# EAGLE schematic EIB64-ST4-Multi (EAGLE 9.5.0)
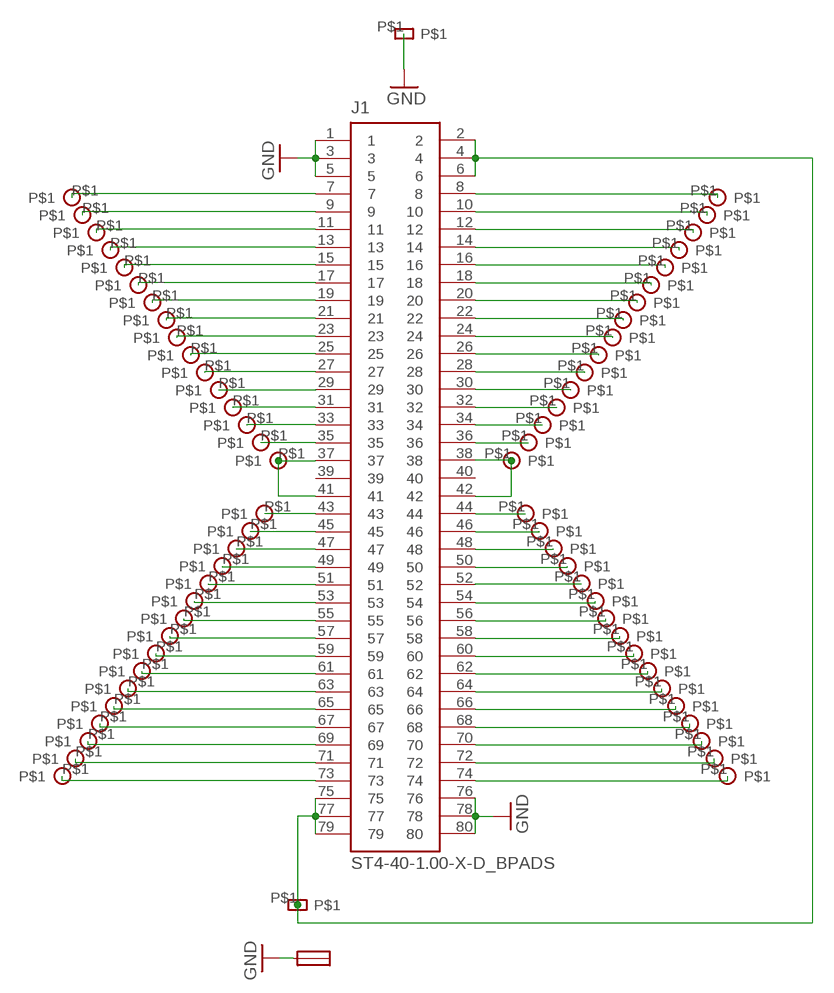
[diagram p0: schematic, sheet 1]

## Parts
J1  ST4-40-1.00-X-D_BPADS  [ST4-40-1.00-X-D_BPADS]
U$1  EIB-GND-HOLE-PAD-SMALL  [EIB-GND-HOLE-PAD-SMALL]
U$2  JMP-PAD-SMALL  [JMP-PAD-SMALL]
U$3  EIB-GND-HOLE-PAD-SMALL  [EIB-GND-HOLE-PAD-SMALL]
U$5  EIB-TETRODE-HOLE-RS-PAD  [EIB-TETRODE-HOLE-RS-PAD]
U$6  EIB-TETRODE-HOLE-RS-PAD  [EIB-TETRODE-HOLE-RS-PAD]
U$7  EIB-TETRODE-HOLE-RS-PAD  [EIB-TETRODE-HOLE-RS-PAD]
U$8  EIB-TETRODE-HOLE-RS-PAD  [EIB-TETRODE-HOLE-RS-PAD]
U$9  EIB-TETRODE-HOLE-RS-PAD  [EIB-TETRODE-HOLE-RS-PAD]
U$10  EIB-TETRODE-HOLE-RS-PAD  [EIB-TETRODE-HOLE-RS-PAD]
U$11  EIB-TETRODE-HOLE-RS-PAD  [EIB-TETRODE-HOLE-RS-PAD]
U$12  EIB-TETRODE-HOLE-RS-PAD  [EIB-TETRODE-HOLE-RS-PAD]
U$13  EIB-TETRODE-HOLE-RS-PAD  [EIB-TETRODE-HOLE-RS-PAD]
U$14  EIB-TETRODE-HOLE-RS-PAD  [EIB-TETRODE-HOLE-RS-PAD]
U$15  EIB-TETRODE-HOLE-RS-PAD  [EIB-TETRODE-HOLE-RS-PAD]
U$16  EIB-TETRODE-HOLE-RS-PAD  [EIB-TETRODE-HOLE-RS-PAD]
U$17  EIB-TETRODE-HOLE-RS-PAD  [EIB-TETRODE-HOLE-RS-PAD]
U$18  EIB-TETRODE-HOLE-RS-PAD  [EIB-TETRODE-HOLE-RS-PAD]
U$19  EIB-TETRODE-HOLE-RS-PAD  [EIB-TETRODE-HOLE-RS-PAD]
U$20  EIB-TETRODE-HOLE-RS-PAD  [EIB-TETRODE-HOLE-RS-PAD]
U$21  EIB-TETRODE-HOLE-RS-PAD  [EIB-TETRODE-HOLE-RS-PAD]
U$22  EIB-TETRODE-HOLE-RS-PAD  [EIB-TETRODE-HOLE-RS-PAD]
U$23  EIB-TETRODE-HOLE-RS-PAD  [EIB-TETRODE-HOLE-RS-PAD]
U$24  EIB-TETRODE-HOLE-RS-PAD  [EIB-TETRODE-HOLE-RS-PAD]
U$25  EIB-TETRODE-HOLE-RS-PAD  [EIB-TETRODE-HOLE-RS-PAD]
U$26  EIB-TETRODE-HOLE-RS-PAD  [EIB-TETRODE-HOLE-RS-PAD]
U$27  EIB-TETRODE-HOLE-RS-PAD  [EIB-TETRODE-HOLE-RS-PAD]
U$28  EIB-TETRODE-HOLE-RS-PAD  [EIB-TETRODE-HOLE-RS-PAD]
U$29  EIB-TETRODE-HOLE-RS-PAD  [EIB-TETRODE-HOLE-RS-PAD]
U$30  EIB-TETRODE-HOLE-RS-PAD  [EIB-TETRODE-HOLE-RS-PAD]
U$31  EIB-TETRODE-HOLE-RS-PAD  [EIB-TETRODE-HOLE-RS-PAD]
U$32  EIB-TETRODE-HOLE-RS-PAD  [EIB-TETRODE-HOLE-RS-PAD]
U$33  EIB-TETRODE-HOLE-RS-PAD  [EIB-TETRODE-HOLE-RS-PAD]
U$34  EIB-TETRODE-HOLE-RS-PAD  [EIB-TETRODE-HOLE-RS-PAD]
U$35  EIB-TETRODE-HOLE-RS-PAD  [EIB-TETRODE-HOLE-RS-PAD]
U$36  EIB-TETRODE-HOLE-RS-PAD  [EIB-TETRODE-HOLE-RS-PAD]
U$37  EIB-TETRODE-HOLE-RS-PAD  [EIB-TETRODE-HOLE-RS-PAD]
U$38  EIB-TETRODE-HOLE-RS-PAD  [EIB-TETRODE-HOLE-RS-PAD]
U$39  EIB-TETRODE-HOLE-RS-PAD  [EIB-TETRODE-HOLE-RS-PAD]
U$40  EIB-TETRODE-HOLE-RS-PAD  [EIB-TETRODE-HOLE-RS-PAD]
U$41  EIB-TETRODE-HOLE-RS-PAD  [EIB-TETRODE-HOLE-RS-PAD]
U$42  EIB-TETRODE-HOLE-RS-PAD  [EIB-TETRODE-HOLE-RS-PAD]
U$43  EIB-TETRODE-HOLE-RS-PAD  [EIB-TETRODE-HOLE-RS-PAD]
U$44  EIB-TETRODE-HOLE-RS-PAD  [EIB-TETRODE-HOLE-RS-PAD]
U$45  EIB-TETRODE-HOLE-RS-PAD  [EIB-TETRODE-HOLE-RS-PAD]
U$46  EIB-TETRODE-HOLE-RS-PAD  [EIB-TETRODE-HOLE-RS-PAD]
U$47  EIB-TETRODE-HOLE-RS-PAD  [EIB-TETRODE-HOLE-RS-PAD]
U$48  EIB-TETRODE-HOLE-RS-PAD  [EIB-TETRODE-HOLE-RS-PAD]
U$49  EIB-TETRODE-HOLE-RS-PAD  [EIB-TETRODE-HOLE-RS-PAD]
U$50  EIB-TETRODE-HOLE-RS-PAD  [EIB-TETRODE-HOLE-RS-PAD]
U$51  EIB-TETRODE-HOLE-RS-PAD  [EIB-TETRODE-HOLE-RS-PAD]
U$52  EIB-TETRODE-HOLE-RS-PAD  [EIB-TETRODE-HOLE-RS-PAD]
U$53  EIB-TETRODE-HOLE-RS-PAD  [EIB-TETRODE-HOLE-RS-PAD]
U$54  EIB-TETRODE-HOLE-RS-PAD  [EIB-TETRODE-HOLE-RS-PAD]
U$55  EIB-TETRODE-HOLE-RS-PAD  [EIB-TETRODE-HOLE-RS-PAD]
U$56  EIB-TETRODE-HOLE-RS-PAD  [EIB-TETRODE-HOLE-RS-PAD]
U$57  EIB-TETRODE-HOLE-RS-PAD  [EIB-TETRODE-HOLE-RS-PAD]
U$58  EIB-TETRODE-HOLE-RS-PAD  [EIB-TETRODE-HOLE-RS-PAD]
U$59  EIB-TETRODE-HOLE-RS-PAD  [EIB-TETRODE-HOLE-RS-PAD]
U$60  EIB-TETRODE-HOLE-RS-PAD  [EIB-TETRODE-HOLE-RS-PAD]
U$61  EIB-TETRODE-HOLE-RS-PAD  [EIB-TETRODE-HOLE-RS-PAD]
U$62  EIB-TETRODE-HOLE-RS-PAD  [EIB-TETRODE-HOLE-RS-PAD]
U$63  EIB-TETRODE-HOLE-RS-PAD  [EIB-TETRODE-HOLE-RS-PAD]
U$64  EIB-TETRODE-HOLE-RS-PAD  [EIB-TETRODE-HOLE-RS-PAD]
U$65  EIB-TETRODE-HOLE-RS-PAD  [EIB-TETRODE-HOLE-RS-PAD]
U$66  EIB-TETRODE-HOLE-RS-PAD  [EIB-TETRODE-HOLE-RS-PAD]
U$67  EIB-TETRODE-HOLE-RS-PAD  [EIB-TETRODE-HOLE-RS-PAD]
U$68  EIB-TETRODE-HOLE-RS-PAD  [EIB-TETRODE-HOLE-RS-PAD]

## Nets
GND [thick]: J1.1 J1.3 J1.5 J1.76 J1.78 J1.80 U$1.P$1 U$2.P$1
N$1 [thick]: J1.2 J1.4 J1.6 J1.75 J1.77 J1.79 U$3.P$1
N$2 [thick]: J1.35 U$7.P$1
N$3 [thick]: J1.36 U$5.P$1
N$4 [thick]: J1.34 U$9.P$1
N$5 [thick]: J1.20 U$16.P$1
N$6 [thick]: J1.22 U$15.P$1
N$7 [thick]: J1.24 U$14.P$1
N$8 [thick]: J1.26 U$13.P$1
N$9 [thick]: J1.28 U$12.P$1
N$13 [thick]: J1.30 U$11.P$1
N$14 [thick]: J1.37 J1.41 U$8.P$1
N$15 [thick]: J1.32 U$10.P$1
N$16 [thick]: J1.74 U$52.P$1
N$17 [thick]: J1.18 U$17.P$1
N$18 [thick]: J1.16 U$18.P$1
N$19 [thick]: J1.14 U$19.P$1
N$20 [thick]: J1.12 U$20.P$1
N$21 [thick]: J1.10 U$21.P$1
N$22 [thick]: J1.8 U$22.P$1
N$23 [thick]: J1.33 U$23.P$1
N$24 [thick]: J1.31 U$24.P$1
N$25 [thick]: J1.29 U$25.P$1
N$26 [thick]: J1.27 U$26.P$1
N$27 [thick]: J1.25 U$27.P$1
N$28 [thick]: J1.23 U$28.P$1
N$29 [thick]: J1.21 U$29.P$1
N$30 [thick]: J1.19 U$30.P$1
N$31 [thick]: J1.17 U$31.P$1
N$32 [thick]: J1.15 U$32.P$1
N$33 [thick]: J1.13 U$33.P$1
N$34 [thick]: J1.11 U$34.P$1
N$35 [thick]: J1.9 U$35.P$1
N$36 [thick]: J1.7 U$36.P$1
N$37 [thick]: J1.72 U$51.P$1
N$38 [thick]: J1.70 U$50.P$1
N$39 [thick]: J1.68 U$49.P$1
N$40 [thick]: J1.66 U$48.P$1
N$41 [thick]: J1.64 U$47.P$1
N$42 [thick]: J1.62 U$46.P$1
N$43 [thick]: J1.60 U$45.P$1
N$44 [thick]: J1.58 U$44.P$1
N$45 [thick]: J1.56 U$43.P$1
N$46 [thick]: J1.54 U$42.P$1
N$47 [thick]: J1.52 U$41.P$1
N$48 [thick]: J1.50 U$40.P$1
N$49 [thick]: J1.48 U$39.P$1
N$50 [thick]: J1.46 U$38.P$1
N$51 [thick]: J1.44 U$37.P$1
N$52 [thick]: J1.38 J1.42 U$6.P$1
N$53 [thick]: J1.43 U$53.P$1
N$54 [thick]: J1.45 U$54.P$1
N$55 [thick]: J1.47 U$55.P$1
N$56 [thick]: J1.49 U$56.P$1
N$57 [thick]: J1.51 U$57.P$1
N$58 [thick]: J1.53 U$58.P$1
N$59 [thick]: J1.55 U$59.P$1
N$60 [thick]: J1.57 U$60.P$1
N$61 [thick]: J1.59 U$61.P$1
N$62 [thick]: J1.61 U$62.P$1
N$63 [thick]: J1.63 U$63.P$1
N$64 [thick]: J1.65 U$64.P$1
N$65 [thick]: J1.67 U$65.P$1
N$66 [thick]: J1.69 U$66.P$1
N$67 [thick]: J1.71 U$67.P$1
N$68 [thick]: J1.73 U$68.P$1
Unconnected: J1.39 J1.40

## Library data of the parts
J1 = ST4-40-1.00-X-D_custom:ST4-40-1.00-X-D_BPADS: 0.4MM TERMINAL STRIP ASSEMBLY.
U$1 U$3 = EIBLibrary:EIB-GND-HOLE-PAD-SMALL
U$2 = EIBLibrary:JMP-PAD-SMALL
U$5-U$68 = EIBLibrary:EIB-TETRODE-HOLE-RS-PAD

## Net classes
1 thick: width 0.102 mm